# Altium schematic sheet IO_Receiver.SchDoc: IO Receiver
size Letter; Engineer: Brandt Buchda; Revision: B; SheetNumber: 3; SheetTotal: 4
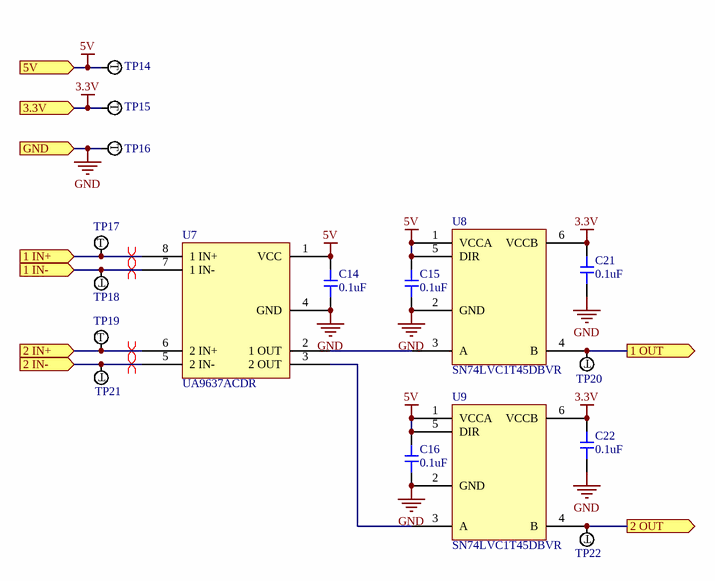
[diagram p0: IO_Receiver.SchDoc]

## Parts
C14  value 0.1uF  [0603-CAP]  (hidden comment: CC0603KRX7R8BB104)
C15  value 0.1uF  [0603-CAP]  (hidden comment: CC0603KRX7R8BB104)
C16  value 0.1uF  [0603-CAP]  (hidden comment: CC0603KRX7R8BB104)
C21  value 0.1uF  [0603-CAP]  (hidden comment: CC0603KRX7R8BB104)
C22  value 0.1uF  [0603-CAP]  (hidden comment: CC0603KRX7R8BB104)
TP14  RCU-0C  [RCU-0C]  (value not drawn)
TP15  RCU-0C  [RCU-0C]  (value not drawn)
TP16  RCU-0C  [RCU-0C]  (value not drawn)
TP17  RCU-0C  [RCU-0C]  (value not drawn)
TP18  RCU-0C  [RCU-0C]  (value not drawn)
TP19  RCU-0C  [RCU-0C]  (value not drawn)
TP20  RCU-0C  [RCU-0C]  (value not drawn)
TP21  RCU-0C  [RCU-0C]  (value not drawn)
TP22  RCU-0C  [RCU-0C]  (value not drawn)
U7  UA9637ACDR  [SOIC127P600X175-8N]
U8  SN74LVC1T45DBVR  [SOT95P280X145-6N]
U9  SN74LVC1T45DBVR  [SOT95P280X145-6N]

## Ports
1 IN+ (in), 1 IN- (in), 1 OUT (out), 2 IN+ (in), 2 IN- (in), 2 OUT (out), 3.3V (in), 5V (in), GND (in)

## Nets
3.3V: C21.2 C22.2 TP15.1 U8.6(VCCB) U9.6(VCCB) ; port 3.3V
5V: C14.2 C15.2 C16.2 TP14.1 U7.1(VCC) U8.1(VCCA) U8.5(DIR) U9.1(VCCA) U9.5(DIR) ; port 5V
GND: C14.1 C15.1 C16.1 C21.1 C22.1 TP16.1 U7.4(GND) U8.2(GND) U9.2(GND) ; port GND
1 IN+: TP17.1 U7.8(1_IN+) ; port 1 IN+
1 IN-: TP18.1 U7.7(1_IN-) ; port 1 IN-
1 OUT: TP20.1 U8.4(B) ; port 1 OUT
2 IN+: TP19.1 U7.6(2_IN+) ; port 2 IN+
2 IN-: TP21.1 U7.5(2_IN-) ; port 2 IN-
2 OUT: TP22.1 U9.4(B) ; port 2 OUT
NetU7_2: U7.2(1_OUT) U8.3(A)
NetU7_3: U7.3(2_OUT) U9.3(A)

## Layout directives
differential pair: 1 IN+, 1 IN-, 2 IN+, 2 IN-

## Notes on the sheet
- Title:
- File:
- Sheet:
- of
- Revision:
- Time:
- Date:
- Engineer:
- (in symbol Test Point) T

## Library data of the parts
C14-C16 C21 C22 = Capacitor 0.1uF: 0.1µF ±10% 25V Ceramic Capacitor X7R 0603 (1608 Metric); Manufacturer 1: Yageo; Supplier 1: Digi-Key; Supplier Part Number 1: 311-1341-1-ND; Manufacturer Part Number 1: CC0603KRX7R8BB104
TP14-TP22 = Test Point: PC TEST POINT NATURAL; Material - Insulation: No Insulation; Manufacturer Part Number: RCU-0C; Supplier Part Number: *; Supplier: *; Footprint: *; Supplier 1: Digi-Key; RoHS: RoHS Compliant; Category: Test and Measurement; Stock 1: 136646; Pricing 1: 1=0.22, 10=0.206, 25=0.1756, 50=0.1536, 100=0.1426, 250=0.12616, 500=0.12068, 1000=0.09874 (USD); Packaging: Cut Tape (CT); Part Status: Active; Type: PC Test Point; Mounting Type: Surface Mount; Color: Natural; Size / Dimension: 0.063" x 0.031" x 0.045" (1.60mm x 0.80mm x 1.15mm); Plating: -; Material - Body: -; ComponentLink1URL: http://www.te.com/commerce/DocumentDelivery/DDEController?Action=srchrtrv&DocNm=1773266&DocType=DS&DocLang=English; ComponentLink1Description: http://www.te.com/commerce/DocumentDelivery/DDEController?Action=srchrtrv&DocNm=1773266&DocType=DS&DocLang=English; Supplier Part Number 1: A106145CT-ND
U7 = UA9637ACDR: IC RECEIVER 0/2 8SOIC; Supplier 1: DigiKey; Supplier Part Number 1: 296-15056-1-ND
U8 U9 = SN74LVC1T45DBVR: IC TRNSLTR BIDIRECTIONAL SOT23-6; Supplier 1: Digi-Key; Supplier Part Number 1: 296-16843-1-ND